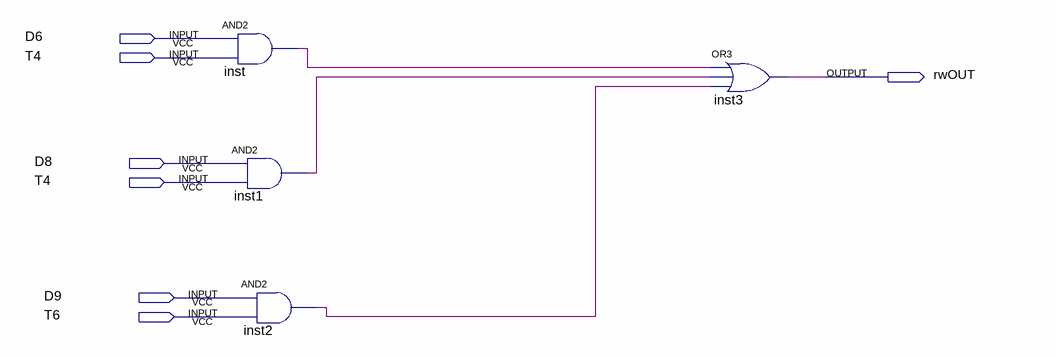
[diagram p0: schematic sheet]
// Quartus schematic rw.bdf as structural Verilog: 4 symbols, 7 pins
module rw (
  input  D6,
  input  T4,
  input  D8,
  input  D9,
  input  T6,
  output rwOUT
);

  wire inst1_out, inst2_out, inst_out;

  and inst (inst_out, D6, T4);
  and inst1 (inst1_out, D8, T4);
  and inst2 (inst2_out, D9, T6);
  or inst3 (rwOUT, inst_out, inst1_out, inst2_out);
endmodule
